# Altium schematic sheet TDC_VTUNE_DAC.SchDoc: FMC 5GS/s ADC/TDC
size 420 x 297 mm; DrawnBy: A. Bartkowicz; Engineer: A. Bartkowicz; Revision: 1; SheetNumber: 8; SheetTotal: 13; ModifiedBy: -; CheckedDate: -; Title2: DAC circuit for Varicaps; DivGrp: WUT ISE; Designer: A. Bartkowicz
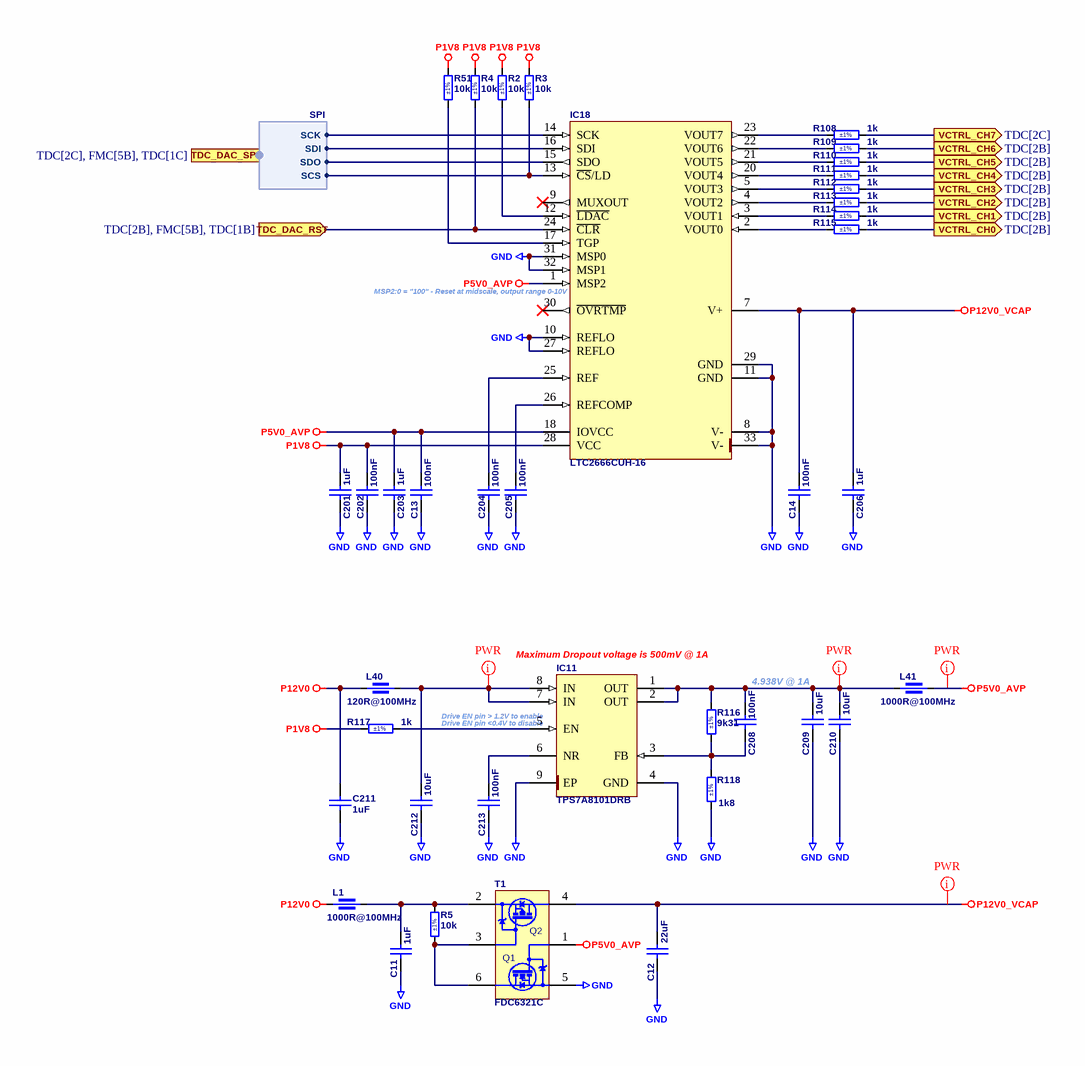
[diagram p0: TDC_VTUNE_DAC.SchDoc]

## Parts
C11  1uF  [CAPC1005X55N]
C12  22uF  [CAPC2012X135N]
C13  100nF  [CAPC1005X55N]
C14  100nF  [CAPC1005X55N]
C201  1uF  [CAPC1608X87N]
C202  100nF  [CAPC1005X55N]
C203  1uF  [CAPC1608X87N]
C204  100nF  [CAPC1005X55N]
C205  100nF  [CAPC1005X55N]
C206  1uF  [CAPC1608X87N]
C208  100nF  [CAPC1005X55N]
C209  10uF  [CAPC1608X90N]
C210  10uF  [CAPC1608X90N]
C211  1uF  [CAPC1005X55N]
C212  10uF  [CAPC1608X90N]
C213  100nF  [CAPC1005X55N]
IC11  TPS7A8101DRB  [TEXAS_DRB(S-PVSON-N8)]
IC18  LTC2666CUH-16  [QFN50P500X500X80-33N-S355]
L1  1000R@100MHz  [INDC1608X95N]
L40  120R@100MHz  [INDC1005X55N]
L41  1000R@100MHz  [INDC1608X95N]
R2  10k  Tolerance: ±1%  [RESC1005X40N]
R3  10k  Tolerance: ±1%  [RESC1005X40N]
R4  10k  Tolerance: ±1%  [RESC1005X40N]
R5  10k  Tolerance: ±1%  [RESC1005X40N]
R51  10k  Tolerance: ±1%  [RESC1005X40N]
R108  1k  Tolerance: ±1%  [RESC1005X40N]
R109  1k  Tolerance: ±1%  [RESC1005X40N]
R110  1k  Tolerance: ±1%  [RESC1005X40N]
R111  1k  Tolerance: ±1%  [RESC1005X40N]
R112  1k  Tolerance: ±1%  [RESC1005X40N]
R113  1k  Tolerance: ±1%  [RESC1005X40N]
R114  1k  Tolerance: ±1%  [RESC1005X40N]
R115  1k  Tolerance: ±1%  [RESC1005X40N]
R116  9k31  Tolerance: ±1%  [RESC1005X40N]
R117  1k  Tolerance: ±1%  [RESC1005X40N]
R118  1k8  Tolerance: ±1%  [RESC1005X40N]
T1  FDC6321C  [SOT95P280X110-6N]

## Ports
TDC_DAC_RST (in, see TDC[2B], FMC[5B], TDC[1B]), TDC_DAC_SPI (in, harness SPI, see TDC[2C], FMC[5B], TDC[1C]), VCTRL_CH0 (out, see TDC[2B]), VCTRL_CH1 (out, see TDC[2B]), VCTRL_CH2 (out, see TDC[2B]), VCTRL_CH3 (out, see TDC[2B]), VCTRL_CH4 (out, see TDC[2B]), VCTRL_CH5 (out, see TDC[2B]), VCTRL_CH6 (out, see TDC[2B]), VCTRL_CH7 (out, see TDC[2C])

## Harnesses
SPI: SDI, SDO, SCK, SCS

## Nets
GND: C11.1 C12.1 C13.1 C14.1 C201.1 C202.1 C203.1 C204.1 C205.1 C206.1 C209.1 C210.1 C211.1 C212.1 C213.1 IC11.4(GND) IC11.9(EP) IC18.8(V-) IC18.10(REFLO) IC18.11(GND) IC18.27(REFLO) IC18.29(GND) IC18.31(MSP0) IC18.32(MSP1) IC18.33(V-) R118.1 T1.5(S1)
P1V8: C201.2 C202.2 IC18.28(VCC) R2.2 R3.2 R4.2 R51.2 R117.1
P5V0_AVP: C13.2 C203.2 IC18.1(MSP2) IC18.18(IOVCC) L41.2 T1.1(G1)
P12V0: C211.2 L1.1 L40.1
P12V0_VCAP: C12.2 C14.2 C206.2 IC18.7(V+) T1.4(D2)
TDC_DAC_RST: IC18.24(~{CLR}) R4.1 ; port TDC_DAC_RST
VCTRL_CH0: R115.2 ; port VCTRL_CH0
VCTRL_CH1: R114.2 ; port VCTRL_CH1
VCTRL_CH2: R113.2 ; port VCTRL_CH2
VCTRL_CH3: R112.2 ; port VCTRL_CH3
VCTRL_CH4: R111.2 ; port VCTRL_CH4
VCTRL_CH5: R110.2 ; port VCTRL_CH5
VCTRL_CH6: R109.2 ; port VCTRL_CH6
VCTRL_CH7: R108.2 ; port VCTRL_CH7
NetC11_2: C11.2 L1.2 R5.2 T1.2(S2)
NetC204_2: C204.2 IC18.25(REF)
NetC205_2: C205.2 IC18.26(REFCOMP)
NetC208_1: C208.1 IC11.3(FB) R116.1 R118.2
NetC208_2: C208.2 C209.2 C210.2 IC11.1(OUT) IC11.2(OUT) L41.1 R116.2
NetC212_2: C212.2 IC11.7(IN) IC11.8(IN) L40.2
NetC213_2: C213.2 IC11.6(NR)
NetIC11_5: IC11.5(EN) R117.2
NetIC18_2: IC18.2(VOUT0) R115.1
NetIC18_3: IC18.3(VOUT1) R114.1
NetIC18_4: IC18.4(VOUT2) R113.1
NetIC18_5: IC18.5(VOUT3) R112.1
NetIC18_12: IC18.12(~{LDAC}) R2.1
NetIC18_13: IC18.13(~{CS}/LD) R3.1 ; port TDC_DAC_SPI.SCS
NetIC18_14: IC18.14(SCK) ; port TDC_DAC_SPI.SCK
NetIC18_15: IC18.15(SDO) ; port TDC_DAC_SPI.SDO
NetIC18_16: IC18.16(SDI) ; port TDC_DAC_SPI.SDI
NetIC18_17: IC18.17(TGP) R51.1
NetIC18_20: IC18.20(VOUT4) R111.1
NetIC18_21: IC18.21(VOUT5) R110.1
NetIC18_22: IC18.22(VOUT6) R109.1
NetIC18_23: IC18.23(VOUT7) R108.1
NetR5_1: R5.1 T1.3(G2) T1.6(D1)

Not connected (* = marked no-connect by the designer): IC18 9(MUXOUT)* 30(~{OVRTMP})*

## Layout directives
net class PWR: NetC208_2, NetC212_2, P5V0_AVP, P12V0_VCAP

## Notes on the sheet
- (near IC18) MSP2:0 = "100" - Reset at midscale, output range 0-10V
- (near IC11) Maximum Dropout voltage is 500mV @ 1A
- 4.938V @ 1A
- (near IC11) Drive EN pin > 1.2V to enable
- (near IC11) Drive EN pin <0.4V to disable
- Project/Equipment
- Document
- Designer
- Drawn by
- Check.by
- Copyright WUT ISE 2024.
  This documentation describes Open Hardware and is licensed under the CERN OHL v.2. You may redistribute and modify this documentation under the terms of the CERN OHL v.2. (http://ohwr.org/CERNOHL). This documentation is distributed WITHOUT ANY EXPRESS OR IMPLIED WARRANTY, INCLUDING OF MERCHANTABILITY, SATISFACTORY QUALITY AND FITNESS FOR A PARTICULAR PURPOSE. Please see the CERN OHL v.2 for applicable conditions.
- Contact
- File
- Last Mod.
- Print Date
- Sheet
- Size
- A3
- of
- Rev
- (in symbol FDC6321C) Q2; Q1

## Library data of the parts
C11 C211 = CC0402_1UF_16V_10%_X5R: Non-polarised capacitor; Part Description: SMD Multilayer Chip Ceramic Capacitor; Manufacturer: GENERIC; Manufacturer1 Part Number: C1005X5R1C105KT; Voltage: 16V; TC: X5R; Tolerance: ±10%; Part Number: CC0402_1UF_16V_10%_X5R; Component Kind: Standard; Component Type: Standard; Pin Count: 2; Value: 1uF; Status: Preferred; Manufacturer Part Number: CC0402_1UF_16V_10%_X5R; Case: 0402; Mounted: Yes; Socket: No; SMD: Yes; Sense: No; Manufacturer1 Example: TDK; Manufacturer1 ComponentHeight: 0.55mm; HelpURL: \\cern.ch\dfs\Applications\Altium\Datasheets\CC0402_X5R_TDK_C.pdf; Author: CERN DEM JLC; CreateDate: 25.10.2012; LatestRevisionDate: 25.10.2012
C12 = CC0805_22UF_16V_10%_X5R: Non-polarised capacitor; Manufacturer: GENERIC; Part Description: SMD Multilayer Chip Ceramic Capacitor; Manufacturer1 Part Number: C2012X5R1C226KT; Tolerance: ±10%; Voltage: 16V; TC: X5R; Manufacturer Part Number: CC0805_22UF_16V_10%_X5R; Part Number: CC0805_22UF_16V_10%_X5R; Value: 22uF; Component Kind: Standard; Component Type: Standard; Pin Count: 2; Status: Preferred; Case: 0805; Mounted: Yes; Socket: No; SMD: Yes; Sense: No; Manufacturer1 Example: TDK; Manufacturer1 ComponentHeight: 1.35mm; HelpURL: \\cern.ch\dfs\Applications\Altium\Datasheets\CC0805_X5R_TDK_C.pdf; Author: CERN DEM JLC; CreateDate: 25.10.2012; LatestRevisionDate: 25.10.2012
C13 C14 C202 C204 C205 C208 C213 = CC0402_100NF_16V_10%_X5R: Non-polarised capacitor; Part Description: SMD Multilayer Chip Ceramic Capacitor; Manufacturer: GENERIC; Manufacturer1 Part Number: GRM155R61C104KA88D; Voltage: 16V; TC: X5R; Tolerance: ±10%; Part Number: CC0402_100NF_16V_10%_X5R; Component Kind: Standard; Component Type: Standard; Pin Count: 2; Value: 100nF; Status: None; Manufacturer Part Number: CC0402_100NF_16V_10%_X5R; Case: 0402; Mounted: Yes; Socket: No; SMD: Yes; Sense: No; Manufacturer1 Example: MURATA; Manufacturer1 ComponentHeight: 0.55mm; HelpURL: \\cern.ch\dfs\Applications\Altium\Datasheets\CC0402_X5R_MURATA_GRM.pdf; Author: CERN DEM JLC; CreateDate: 10.12.2013; LatestRevisionDate: 10.12.2013
C201 C203 C206 = CC0603_1UF_25V_10%_X7R: Non-polarised capacitor; Part Description: SMD Multilayer Chip Ceramic Capacitor; Manufacturer: GENERIC; Manufacturer1 Part Number: GRM188R71E105KA12D; Voltage: 25V; TC: X7R; Tolerance: ±10%; Part Number: CC0603_1UF_25V_10%_X7R; Component Kind: Standard; Component Type: Standard; Pin Count: 2; Value: 1uF; Status: None; Manufacturer Part Number: CC0603_1UF_25V_10%_X7R; Case: 0603; Mounted: Yes; Socket: No; SMD: Yes; Sense: No; Manufacturer1 Example: MURATA; Manufacturer1 ComponentHeight: 0.9mm; HelpURL: \\cern.ch\dfs\Applications\Altium\Datasheets\CC0603_X7R_MURATA.pdf; Author: CERN DEM JLC; CreateDate: 18.01.2011; LatestRevisionDate: 18.01.2011
C209 C210 C212 = CC0603_10UF_16V_10%_X5R_MURATA_GRT188R61C106KE13: Non-polarised capacitor; Part Description: AEC-Q200 Compliant Chip Multilayer Ceramic Capacitor; Manufacturer: MURATA; Voltage: 16V; TC: X5R; Tolerance: ±10%; Part Number: CC0603_10UF_16V_10%_X5R_MURATA_GRT188R61C106KE13; Component Kind: Standard; Component Type: Standard; Pin Count: 2; Value: 10uF; Status: None; Manufacturer Part Number: GRT188R61C106KE13; Case: 0603; Mounted: Yes; Socket: No; SMD: Yes; Sense: No; ComponentHeight: 0.9mm; HelpURL: \\cern.ch\dfs\Applications\Altium\Datasheets\CC0603_MURATA_GRT188R61C106KE13.pdf; Author: CERN DEM HF; CreateDate: 16.06.2022; LatestRevisionDate: 17.06.2022
IC11 = TPS7A8101DRB: 0.8V to 6V, 1A, Low-Noise, Wide-Bandwidth, High PSRR, Low-Dropout Linear Regulator; Manufacturer: TEXAS INSTRUMENTS; PressFit: No; Bonding: No; Part Number: TPS7A8101DRB; Component Kind: Standard; Component Type: Standard; Device: TPS7A8101DRB; PackageDescription: TEXAS Case Style DRB (S-PVSON-N8), SON, 0.65mm Pitch; 8 Pin, 3.00mm W X 3.00mm L X 1.00mm H body (w/Thermal Tab 1.60 X 1.85mm); Part Description: 0.8V to 6V, 1A, Low-Noise, Wide-Bandwidth, High PSRR, Low-Dropout Linear Regulator; Manufacturer Part Number: TPS7A8101DRB; Pin Count: 9; Case: SON8; Mounted: Yes; Socket: No; SMD: Yes; Sense: No; ComponentHeight: 1mm; HelpURL: \\cern.ch\dfs\Applications\Altium\Datasheets\TPS7A8101DRB.pdf; Author: CERN DEM BC; CreateDate: 18.02.2019; LatestRevisionDate: 18.02.2019
IC18 = LTC2666CUH-16#PBF: Octal 16-Bit, ±10V Vout, SoftSpan DAC with 10ppm/°C Max Reference; Manufacturer: LINEAR TECHNOLOGY; PressFit: No; Bonding: No; Part Number: LTC2666CUH-16#PBF; Component Kind: Standard; Component Type: Standard; Device: LTC2666CUH-16; PackageDescription: QFN, (MO-220-WHHD-X) 0.50mm Pitch, Square; 32 Pin, 5.00mm L X 5.00mm W X 0.80mm H body (w/Thermal Tab 3.55 X 3.55mm), IPC Medium Density; Part Description: Octal 16-Bit, ±10V Vout, SoftSpan DAC with 10ppm/°C Max Reference; Manufacturer Part Number: LTC2666CUH-16; Pin Count: 33; Case: QFN32; Mounted: Yes; Socket: No; SMD: Yes; Sense: No; ComponentHeight: 0.8mm; Author: CERN DEM JLC; HelpURL: \\cern.ch\dfs\Applications\Altium\Datasheets\LTC2666CUH-16#PBF.pdf; CreateDate: 22.11.2018; LatestRevisionDate: 02.02.2022
L1 L41 = IND0603_MURATA_BLM18KG102SN1: Part Description: SMD Chip Ferrite Bead, Automotive; Manufacturer: MURATA; Manufacturer Part Number: BLM18KG102WH1; Power: 1A; Resistance: 0.2R; Tolerance: ±25%; Part Number: IND0603_MURATA_BLM18KG102SN1; Component Kind: Standard; Component Type: Standard; Pin Count: 2; Value: 1000R@100MHz; Case: 0603; Mounted: Yes; Socket: No; SMD: Yes; Sense: No; ComponentHeight: 0.95mm; HelpURL: \\cern.ch\dfs\Applications\Altium\Datasheets\IND0603_MURATA_BLM18KG102SN1.pdf; Author: CERN DEM HF; CreateDate: 15.12.2022; LatestRevisionDate: 15.12.2022
L40 = IND0402_MURATA_BLM15PX121SN1D: Part Description: SMD EMIFIL Chip Ferrite Bead; Manufacturer: MURATA; Power: 2A; Resistance: 0.055R; Tolerance: ±25%; Part Number: IND0402_MURATA_BLM15PX121SN1D; Component Kind: Standard; Component Type: Standard; Pin Count: 2; Value: 120R@100MHz; Manufacturer Part Number: BLM15PX121SN1D; Case: 0402; Mounted: Yes; Socket: No; SMD: Yes; Sense: No; ComponentHeight: 0.55mm; HelpURL: \\cern.ch\dfs\Applications\Altium\Datasheets\IND0402_MURATA_BLM15PX.pdf; Author: CERN DEM JMW; CreateDate: 19.02.2014; LatestRevisionDate: 25.10.2018
R2-R5 R51 = R0402_10K_1%_0.0625W_100PPM: Resistor - 1%; Part Description: General Purpose Thick Film Chip Resistor; Manufacturer: GENERIC; Manufacturer1 Part Number: 232270671003L; TC: ±100ppm/°C; PressFit: No; Part Number: R0402_10K_1%_0.0625W_100PPM; Component Kind: Standard; Component Type: Standard; Pin Count: 2; Value: 10k; Status: Not Recommended; Power: 0.0625W; Manufacturer Part Number: R0402_10K_1%_0.0625W_100PPM; Case: 0402; Mounted: Yes; Sense: No; Socket: No; SMD: Yes; Manufacturer1 Example: YAGEO PHYCOMP; Manufacturer1 ComponentHeight: 0.4mm; HelpURL: \\cern.ch\dfs\Applications\Altium\Datasheets\R0402_Phycomp_RC0402.pdf; Author: CERN DEM JLC; CreateDate: 03.12.2007; LatestRevisionDate: 17.10.2012
R108-R115 R117 = R0402_1K_1%_0.0625W_100PPM: Resistor - 1%; Part Description: General Purpose Thick Film Chip Resistor; Manufacturer: GENERIC; Manufacturer1 Part Number: 232270671002L; TC: ±100ppm/°C; PressFit: No; Part Number: R0402_1K_1%_0.0625W_100PPM; Component Kind: Standard; Component Type: Standard; Pin Count: 2; Value: 1k; Status: Not Recommended; Power: 0.0625W; Manufacturer Part Number: R0402_1K_1%_0.0625W_100PPM; Case: 0402; Mounted: Yes; Sense: No; Socket: No; SMD: Yes; Manufacturer1 Example: YAGEO PHYCOMP; Manufacturer1 ComponentHeight: 0.4mm; HelpURL: \\cern.ch\dfs\Applications\Altium\Datasheets\R0402_Phycomp_RC0402.pdf; Author: CERN DEM JLC; CreateDate: 03.12.2007; LatestRevisionDate: 17.10.2012
R116 = R0402_9K31_1%_0.0625W_100PPM: Resistor - 1%; Part Description: General Purpose Thick Film Chip Resistor; Manufacturer: GENERIC; Manufacturer1 Part Number: 232270679312L or RC0402FR-079K31L; TC: ±100ppm/°C; PressFit: No; Part Number: R0402_9K31_1%_0.0625W_100PPM; Component Kind: Standard; Component Type: Standard; Pin Count: 2; Value: 9k31; Status: Not Recommended; Power: 0.0625W; Manufacturer Part Number: R0402_9K31_1%_0.0625W_100PPM; Case: 0402; Mounted: Yes; Sense: No; Socket: No; SMD: Yes; Manufacturer1 Example: YAGEO PHYCOMP; Manufacturer1 ComponentHeight: 0.4mm; HelpURL: \\cern.ch\dfs\Applications\Altium\Datasheets\R0402_Phycomp_RC0402.pdf; Author: CERN DEM JMW; CreateDate: 06.07.2015; LatestRevisionDate: 06.07.2015
R118 = R0402_1K8_1%_0.0625W_100PPM: Resistor - 1%; Part Description: General Purpose Thick Film Chip Resistor; Manufacturer: GENERIC; Manufacturer1 Part Number: 232270671802L; TC: ±100ppm/°C; PressFit: No; Part Number: R0402_1K8_1%_0.0625W_100PPM; Component Kind: Standard; Component Type: Standard; Pin Count: 2; Value: 1k8; Status: Not Recommended; Power: 0.0625W; Manufacturer Part Number: R0402_1K8_1%_0.0625W_100PPM; Case: 0402; Mounted: Yes; Sense: No; Socket: No; SMD: Yes; Manufacturer1 Example: YAGEO PHYCOMP; Manufacturer1 ComponentHeight: 0.4mm; HelpURL: \\cern.ch\dfs\Applications\Altium\Datasheets\R0402_Phycomp_RC0402.pdf; Author: CERN DEM JLC; CreateDate: 03.12.2007; LatestRevisionDate: 17.10.2012
T1 = FDC6321C: 25V, 680mA N-Channel, and -25V, -460mA P-Channel, Dual Digital FET; Part Description: 25V, 680mA, N-Channel, and -25V, -460mA P-Channel, Dual Digital FET; Manufacturer: ON SEMICONDUCTOR; PressFit: No; Bonding: No; Part Number: FDC6321C; Component Kind: Standard; Component Type: Standard; Device: FDC6321C; PackageDescription: SOT, 0.95mm Pitch; 6 Pin, 1.625mm W X 2.90mm L X 1.10mm H body, IPC Medium Density; Manufacturer Part Number: FDC6321C; Pin Count: 6; Case: SOT23-6; Mounted: Yes; Socket: No; SMD: Yes; Sense: No; ComponentHeight: 1mm; HelpURL: \\cern.ch\dfs\Applications\Altium\Datasheets\FDC6321C.pdf; Author: CERN DEM BC; CreateDate: 22.04.2021; LatestRevisionDate: 22.04.2021